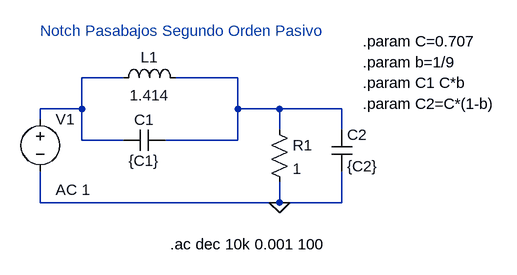
[diagram p0: schematic EJE2_D.asc]
EJE2_D.asc, the LTspice schematic file:
Version 4
SHEET 1 880 680
WIRE 64 64 0 64
WIRE 240 64 144 64
WIRE 0 112 0 64
WIRE 0 112 -64 112
WIRE 240 112 240 64
WIRE 304 112 240 112
WIRE 400 112 304 112
WIRE -64 128 -64 112
WIRE 304 144 304 112
WIRE 400 144 400 112
WIRE 0 160 0 112
WIRE 64 160 0 160
WIRE 240 160 240 112
WIRE 240 160 128 160
WIRE -64 256 -64 208
WIRE 304 256 304 224
WIRE 304 256 -64 256
WIRE 400 256 400 208
WIRE 400 256 304 256
FLAG 304 256 0
SYMBOL ind 48 80 R270
WINDOW 0 32 56 VTop 2
WINDOW 3 5 56 VBottom 2
SYMATTR InstName L1
SYMATTR Value 1.414
SYMBOL cap 128 144 R90
WINDOW 0 0 32 VBottom 2
WINDOW 3 32 32 VTop 2
SYMATTR InstName C1
SYMATTR Value {C1}
SYMBOL res 288 128 R0
SYMATTR InstName R1
SYMATTR Value 1
SYMBOL cap 384 144 R0
SYMATTR InstName C2
SYMATTR Value {C2}
SYMBOL voltage -64 112 R0
WINDOW 123 24 124 Left 2
WINDOW 39 0 0 Left 0
SYMATTR Value2 AC 1
SYMATTR InstName V1
SYMATTR Value ""
TEXT 432 40 Left 2 !.param b=1/9
TEXT 432 72 Left 2 !.param C1 C*b
TEXT 432 104 Left 2 !.param C2=C*(1-b)
TEXT 432 8 Left 2 !.param C=0.707
TEXT 136 320 Left 2 !.ac dec 10k 0.001 100
TEXT -64 -8 Left 2 ;Notch Pasabajos Segundo Orden Pasivo

The netlist it stands for:
* EJE2_D.asc
L1 N001 N002 1.414
C1 N002 N001 {C1}
R1 N002 0 1
C2 N002 0 {C2}
V1 N001 0 AC 1
.param b=1/9
.param C1 C*b
.param C2=C*(1-b)
.param C=0.707
.ac dec 10k 0.001 100
* Notch Pasabajos Segundo Orden Pasivo
.backanno
.end